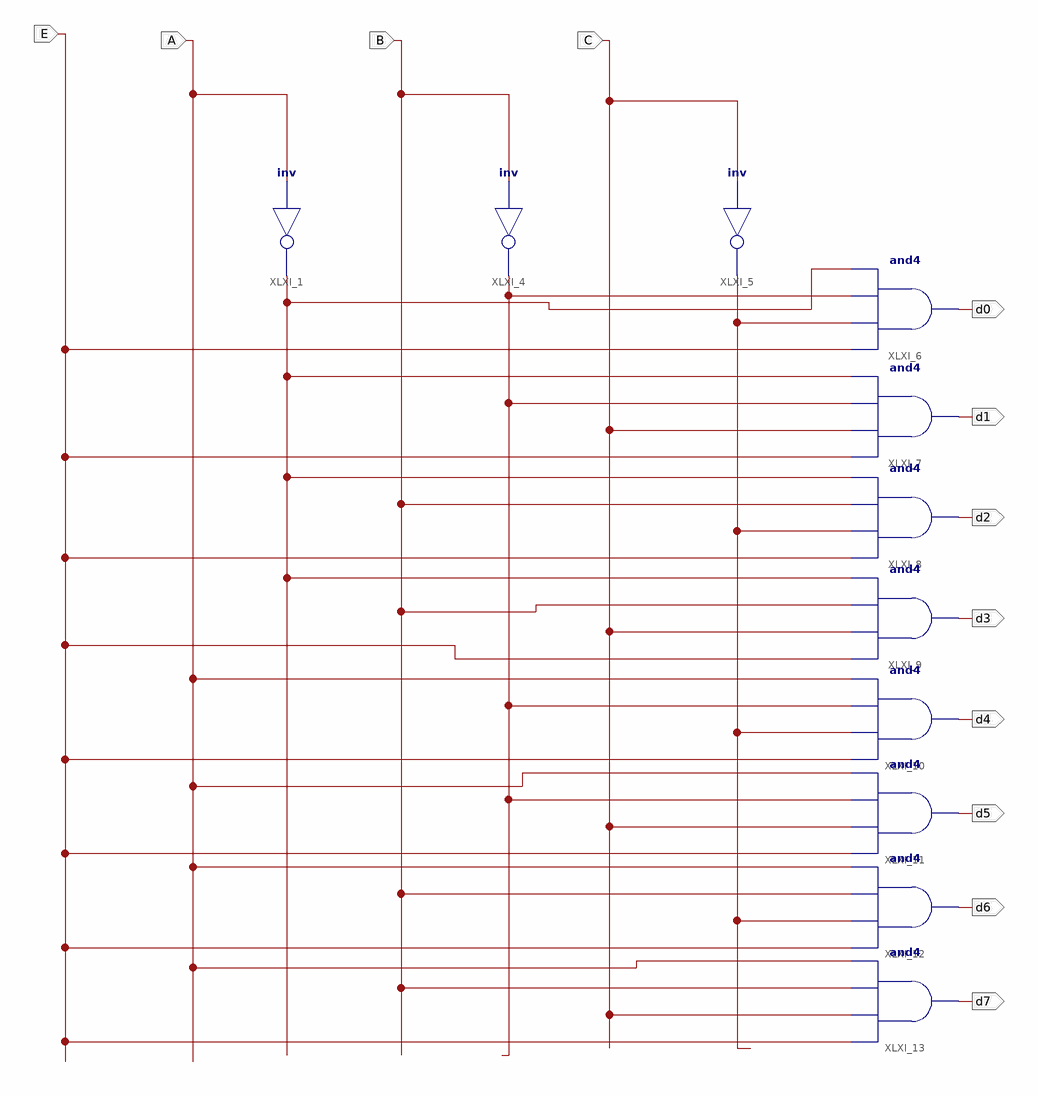
[diagram p0: schematic sheet 1]
// Xilinx ISE schematic sprinkler_circuit.sch (spartan3e) as structural Verilog: 11 symbols, 12 ports
module sprinkler_circuit (
  input  E,
  input  A,
  input  B,
  input  C,
  output d0,
  output d1,
  output d2,
  output d3,
  output d4,
  output d5,
  output d6,
  output d7
);

  wire XLXN_11, XLXN_12, XLXN_15;

  not XLXI_1 (XLXN_11, A);
  not XLXI_4 (XLXN_12, B);
  not XLXI_5 (XLXN_15, C);
  and XLXI_6 (d0, E, XLXN_15, XLXN_12, XLXN_11);
  and XLXI_7 (d1, E, C, XLXN_12, XLXN_11);
  and XLXI_8 (d2, E, XLXN_15, B, XLXN_11);
  and XLXI_9 (d3, E, C, B, XLXN_11);
  and XLXI_10 (d4, E, XLXN_15, XLXN_12, A);
  and XLXI_11 (d5, E, C, XLXN_12, A);
  and XLXI_12 (d6, E, XLXN_15, B, A);
  and XLXI_13 (d7, E, C, B, A);
endmodule
